# Altium schematic sheet Inputs.SchDoc
size A4; DocumentNumber: 1; SheetNumber: 1
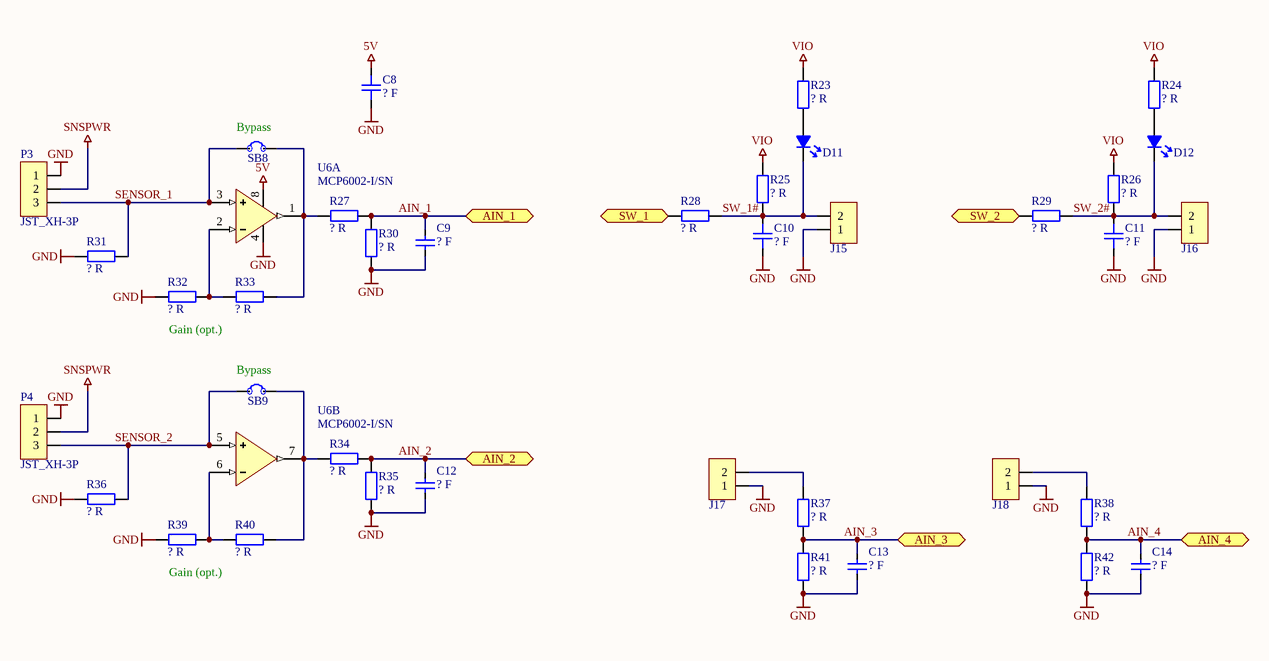
[diagram p0: Inputs.SchDoc]

## Parts
C8  ? F  [0603C_RF_M]
C9  ? F  [0603C_RF_M]
C10  ? F  [0603C_RF_M]
C11  ? F  [0603C_RF_M]
C12  ? F  [0603C_RF_M]
C13  ? F  [0603C_RF_M]
C14  ? F  [0603C_RF_M]
D11  Unspecified  [0805LED_RF_M]  (value not drawn)
D12  Unspecified  [0805LED_RF_M]  (value not drawn)
J15  PINHDR-2P1  [HEADER-2.54-2P1]  (value not drawn)
J16  PINHDR-2P1  [HEADER-2.54-2P1]  (value not drawn)
J17  PINHDR-2P1  [HEADER-2.54-2P1]  (value not drawn)
J18  PINHDR-2P1  [HEADER-2.54-2P1]  (value not drawn)
P3  JST_XH-3P  [JST_B3B-XH-A_LF_SN]
P4  JST_XH-3P  [JST_B3B-XH-A_LF_SN]
R23  ? R  [R0603_RF_M]
R24  ? R  [R0603_RF_M]
R25  ? R  [R0603_RF_M]
R26  ? R  [R0603_RF_M]
R27  ? R  [R0603_RF_M]
R28  ? R  [R0603_RF_M]
R29  ? R  [R0603_RF_M]
R30  ? R  [R0603_RF_M]
R31  ? R  [R0603_RF_M]
R32  ? R  [R0603_RF_M]
R33  ? R  [R0603_RF_M]
R34  ? R  [R0603_RF_M]
R35  ? R  [R0603_RF_M]
R36  ? R  [R0603_RF_M]
R37  ? R  [R0603_RF_M]
R38  ? R  [R0603_RF_M]
R39  ? R  [R0603_RF_M]
R40  ? R  [R0603_RF_M]
R41  ? R  [R0603_RF_M]
R42  ? R  [R0603_RF_M]
SB8  Solder Bridge  [SLDR_BRDG_0603_OPEN]  (value not drawn)
SB9  Solder Bridge  [SLDR_BRDG_0603_OPEN]  (value not drawn)
U6  MCP6002-I/SN  [SOIC-8]  (parts A,B of 2)

## Ports
AIN_1, AIN_2, AIN_3, AIN_4, SW_1, SW_2

## Nets
5V: C8.2 U6.8
GND: C8.1 C9.1 C10.1 C11.1 C12.1 C13.1 C14.1 J15.1 J16.1 J17.1 J18.1 P3.1 P4.1 R30.1 R31.2 R32.2 R35.2 R36.2 R39.2 R41.1 R42.1 U6.4
SNSPWR: P3.2 P4.2
VIO: R23.1 R24.1 R25.2 R26.2
AIN_1: C9.2 R27.2 R30.2 ; port AIN_1
AIN_2: C12.2 R34.1 R35.1 ; port AIN_2
AIN_3: C13.2 R37.1 R41.2 ; port AIN_3
AIN_4: C14.2 R38.1 R42.2 ; port AIN_4
SENSOR_1: P3.3 R31.1 SB8.1 U6.3
SENSOR_2: P4.3 R36.1 SB9.1 U6.5
SW_1: R28.2 ; port SW_1
SW_1#: C10.2 D11.C J15.2 R25.1 R28.1
SW_2: R29.2 ; port SW_2
SW_2#: C11.2 D12.C J16.2 R26.1 R29.1
NetD11_A: D11.A R23.2
NetD12_A: D12.A R24.2
NetJ17_2: J17.2 R37.2
NetJ18_2: J18.2 R38.2
NetR27_1: R27.1 R33.1 SB8.2 U6.1
NetR32_1: R32.1 R33.2 U6.2
NetR34_2: R34.2 R40.1 SB9.2 U6.7
NetR39_1: R39.1 R40.2 U6.6

## Notes on the sheet
- (near SB8) Bypass
- Gain (opt.)
- (near SB9) Bypass
- Author
- Date
- Revision
- Size
- A4
- Sheet
- of

## Library data of the parts
C8-C14 = C: Capacitor; Manufacturer: Generic Brand; Max Voltage: ? V; Value: ? F; Tolerance: ?; Mounting Technology: SMT; Tag: *; Manufacturer Part No: *; Supplier: *; Supplier Link: http://; Supplier Part No: *; Category: Capacitor
D11 D12 = LED: Manufacturer: Generic Brand; Forward Voltage Drop: ? V; Emitting Color: Unspecified; Manufacturer Part No: *; Supplier: *; Supplier Link: http://; Supplier Part No: *; Category: Diode; Mounting Technology: SMT
J15-J18 = PINHDR-2P1: Pin Header Single Row 2 Positions; Mounting Technology: THT
P3 P4 = JST_XH-3P: CONN HEADER VERT 3POS 2.5MM
R23-R42 = R: Resistor; Manufacturer: Generic Brand; Power Rating: ? W; Max Voltage: ? V; Value: ? R; Tolerance: ?; Supplier Link: http://; Category: Resistor; Mounting Technology: SMT
U6 = MCP6002-I/SN: IC OPAMP GP 2 CIRCUIT 8SOIC; DIGIKEY_PART_NO: MCP6002-I/SN-ND; DIGIKEY_URL: https://www.digikey.com/en/products/detail/microchip-technology/MCP6002-I-SN/500876; DIGIKEY_UNIT_PRICE: $0.33